# EAGLE design a (EAGLE 9.6.2)
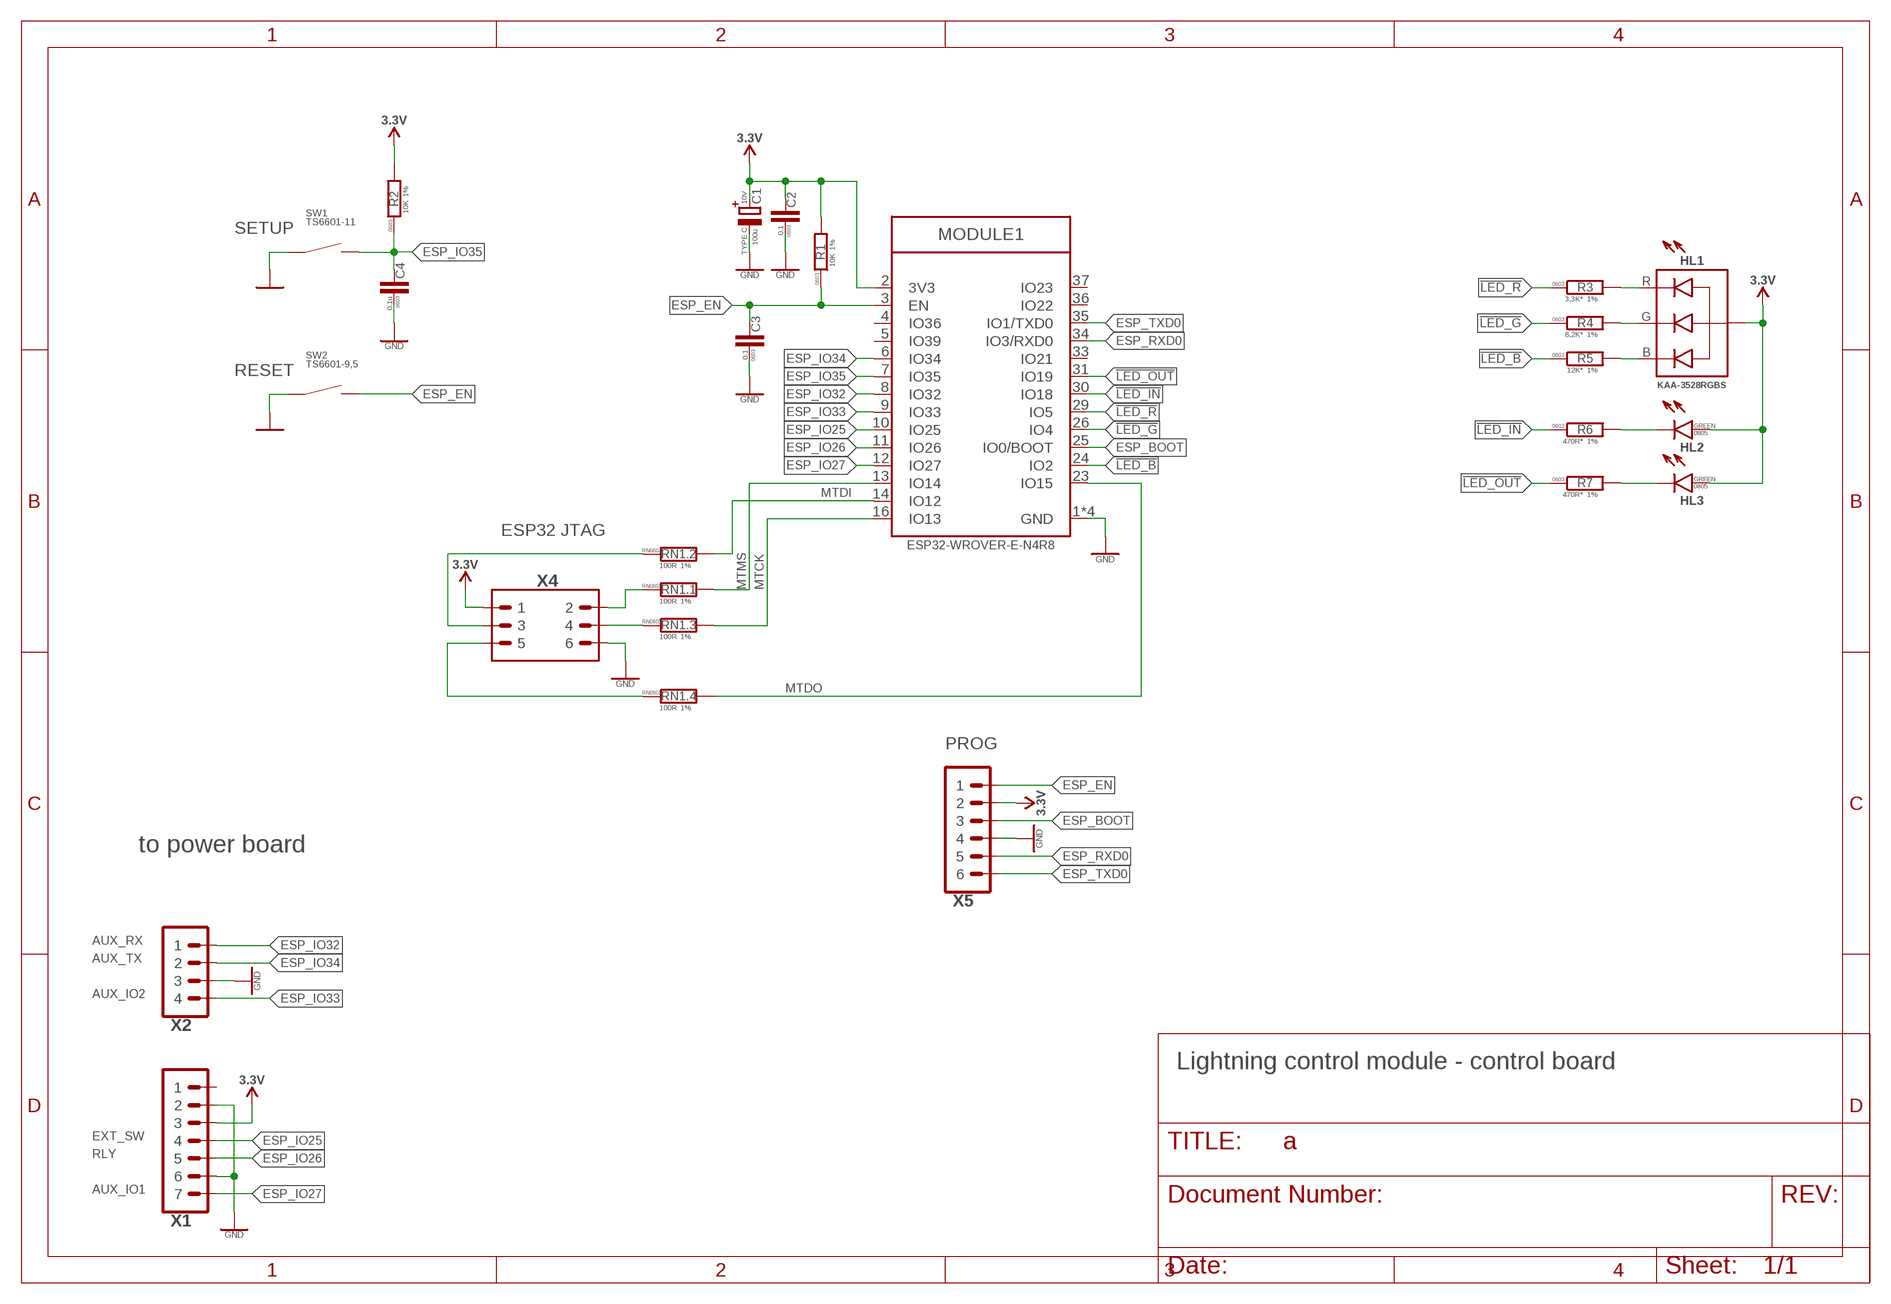
[diagram p0: schematic, sheet 1]

## Parts
C1  100u  CPOL-TANT-TYPE-C  [CTANT_TYPE_C]
C2  0.1  C-0603  [C0603]
C3  0.1  C-0603  [C0603]
C4  0.1u  C-0603  [C0603]
HL1  LED_RGB-KAA-3528RGBS  [LED3528]
HL2  LED-0805  [LED0805]
HL3  LED-0805  [LED0805]
MODULE1  ESP32-WROVER-(I)E  [ESP32-WROVER-E]
R1  10K  R-1%-0603  [R0603]
R2  10K  R-1%-0603  [R0603]
R3  3,3K*  R-1%-0603  [R0603]
R4  8,2K*  R-1%-0603  [R0603]
R5  12K*  R-1%-0603  [R0603]
R6  470R*  R-1%-0603  [R0603]
R7  470R*  R-1%-0603  [R0603]
RN1  100R  RN-1%-0603  [R_4X0603]
SW1  TS6601-11  TACT_SWITCH-6X6-PTH  [SW4-6.0X6.0X5.0MM]
SW2  TS6601-9,5  TACT_SWITCH-6X6-PTH  [SW4-6.0X6.0X5.0MM]
X1  PINHEAD_1X07-2.54  [1X07-PTH-2.54]
X2  PINHEAD_1X04-2.54  [1X04-PTH-2.54]
X4  PINHEAD_2X03-PTH-2.54  [2X03-PTH-2.54]
X5  PINHEAD_1X06-2-MALE  [1X06-PTH-2]

## Nets
!LED_B: MODULE1.24(IO2) R5.1
!LED_G: MODULE1.26(IO4) R4.1
!LED_IN: MODULE1.30(IO18) R6.1
!LED_OUT: MODULE1.31(IO19) R7.1
!LED_R: MODULE1.29(IO5) R3.1
ESP_BOOT: MODULE1.25(IO0/BOOT) X5.3
ESP_EN: C3.2 MODULE1.3(EN) R1.1 SW2.2 SW2.3 X5.1
ESP_IO25: MODULE1.10(IO25) X1.4
ESP_IO26: MODULE1.11(IO26) X1.5
ESP_IO27: MODULE1.12(IO27) X1.7
ESP_IO32: MODULE1.8(IO32) X2.1
ESP_IO33: MODULE1.9(IO33) X2.4
ESP_IO34: MODULE1.6(IO34) X2.2
ESP_IO35: C4.2 MODULE1.7(IO35) R2.1 SW1.2 SW1.3
ESP_RXD0: MODULE1.34(IO3/RXD0) X5.5
ESP_TXD0: MODULE1.35(IO1/TXD0) X5.6
GND: C1.- C2.1 C3.1 C4.1 MODULE1.1(GND) MODULE1.15(GND) MODULE1.38(GND) MODULE1.39(GND) SW1.1 SW1.4 SW2.1 SW2.4 X1.2 X1.6 X2.3 X4.6 X5.4
MTCK: MODULE1.16(IO13) RN1.6
MTDI: MODULE1.14(IO12) RN1.7
MTDO: MODULE1.23(IO15) RN1.5
MTMS: MODULE1.13(IO14) RN1.8
N$1: HL1.4(B) R5.2
N$2: HL1.3(G) R4.2
N$4: HL1.1(R) R3.2
N$8: HL2.C R6.2
N$18: HL3.C R7.2
N$124: RN1.4 X4.5
N$150: RN1.1 X4.2
N$213: RN1.2 X4.3
N$216: RN1.3 X4.4
VDD_3V3: C1.+ C2.2 HL1.2(A) HL2.A HL3.A MODULE1.2(3V3) R1.2 R2.2 X1.3 X4.1 X5.2 ; supply symbol labelled 3.3V
Unconnected: MODULE1.4(IO36) MODULE1.5(IO39) MODULE1.33(IO21) MODULE1.36(IO22) MODULE1.37(IO23) X1.1

## Notes on the sheet
- SETUP
- RESET
- ESP32 JTAG
- PROG
- to power board
- AUX_RX
- AUX_TX
- AUX_IO2
- Lightning control module - control board
- EXT_SW
- RLY
- AUX_IO1

## Library data of the parts
C1 = rc:CPOL: Polar electrolytic or tantalum capacitor; PACKAGE: TYPE C; VOLTAGE: 10V
C2-C4 = rc:C; PACKAGE: 0603
HL1 = rc:LED_RGB; MANF: Kingbright; MANF#: KAA-3528RGBS
HL2 HL3 = rc:LED: Light emitting diode; COLOR: GREEN; PACKAGE: 0805
MODULE1 = ali_modules:ESP32-WROVER-(I)E: ESP32-WROVER-(I)E module Datasheet <https://documentation.espressif.com/esp32-wrover-e_esp32-wrover-ie_datasheet_en.pdf>; MANF: Espressif Systems; MANF#: ESP32-WROVER-E-N4R8
R1-R7 = rc:R; PACKAGE: 0603; TOLERANCE: 1%
RN1 = rc:RN; PACKAGE: RN0603; TOLERANCE: 1%
SW1 SW2 = mechanical:TACT_SWITCH: tact switch; MANF: KLS; MANF#: KLS7-TS6601-4,3-180
X1 = pinhead:PINHEAD_1X07: pinheader 7P
X2 = pinhead:PINHEAD_1X04
X4 = pinhead:PINHEAD_2X03
X5 = pinhead:PINHEAD_1X06: pinheader 6P

## Net classes
1 24V: clearance 0.305 mm
12 Vbat: width 0.229 mm, clearance 0.305 mm

## Board
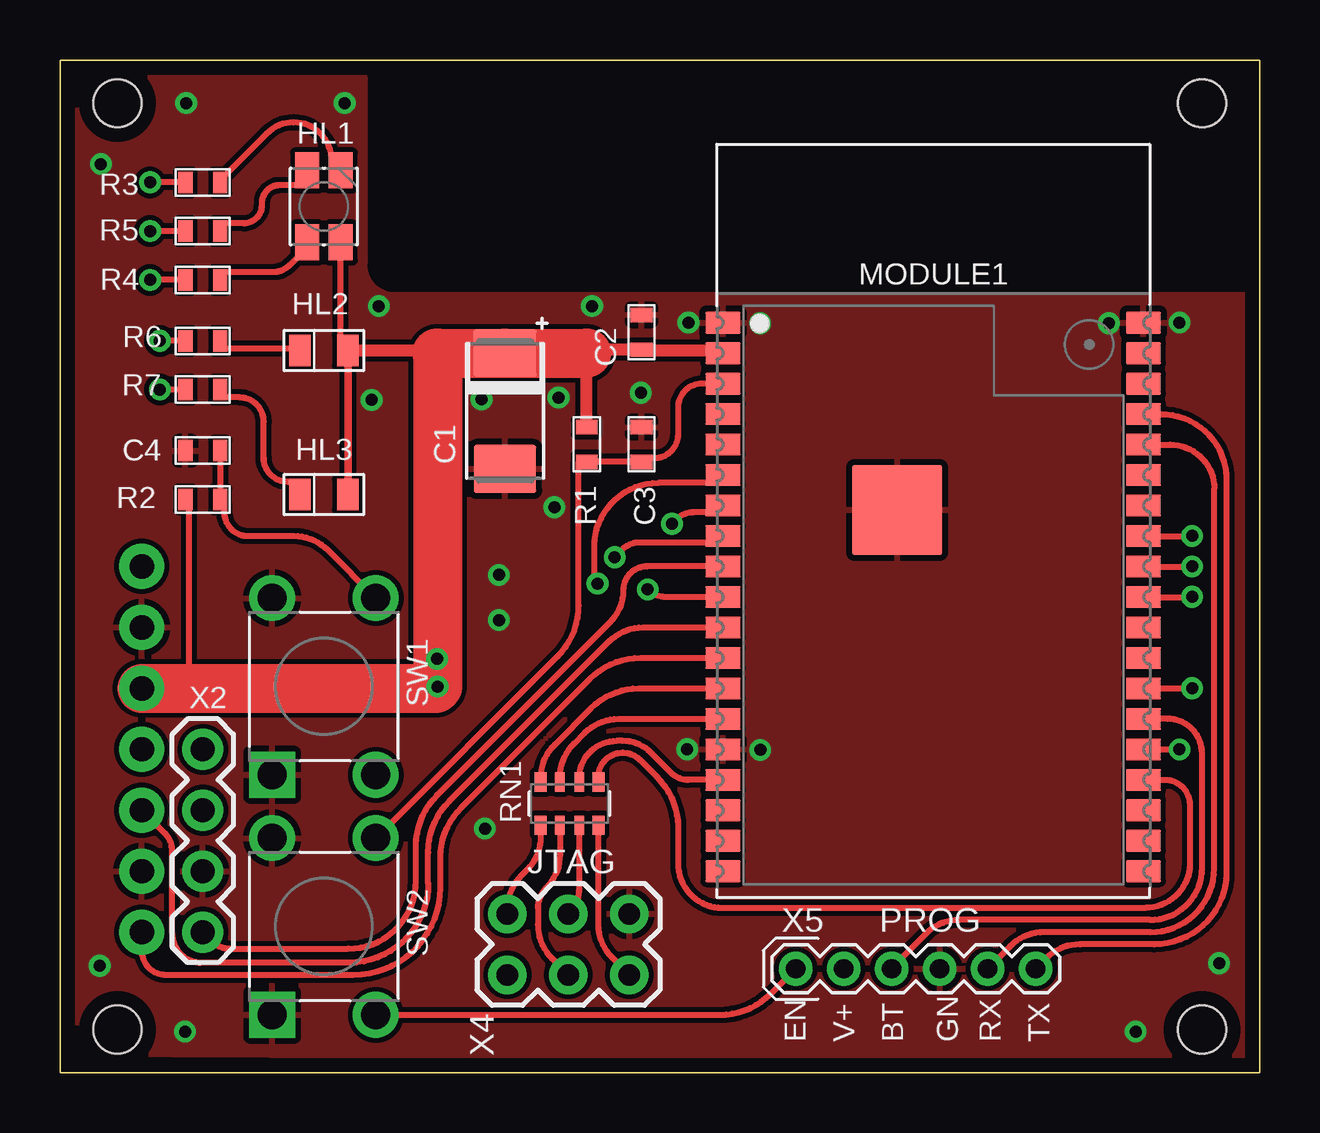
[diagram p1: board, top side]
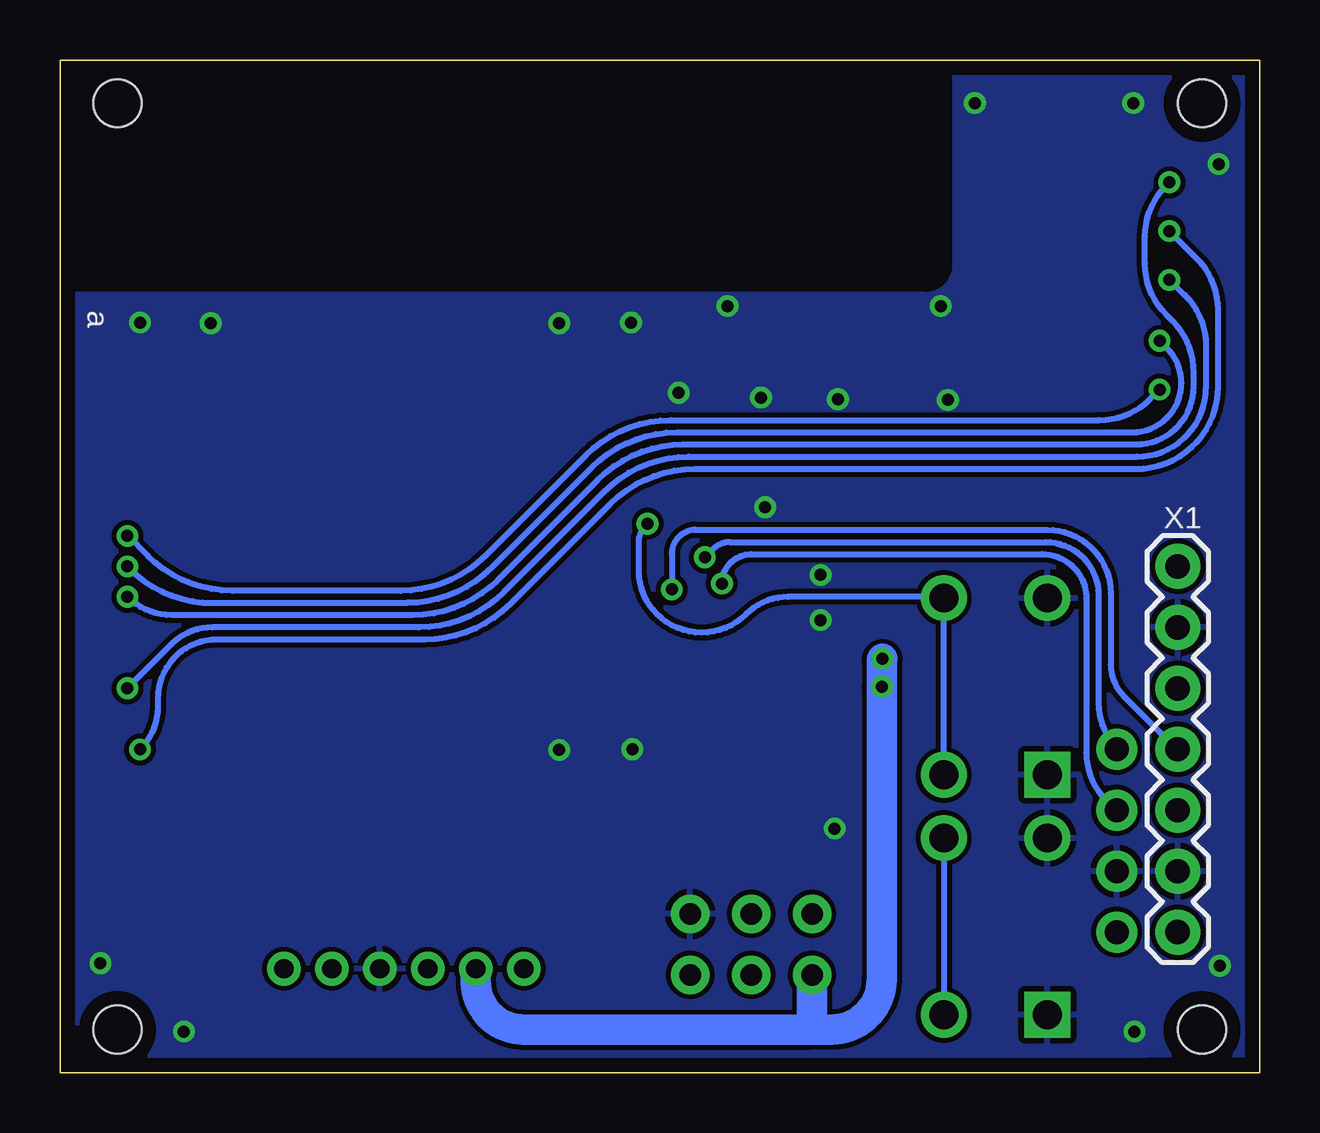
[diagram p2: board, bottom side, seen from below]

Size 50 x 42.2 mm. Coordinates in mm from the lower left corner, seen from the top.
Outline: 0,42.2 50,42.2 50,0 0,0 0,42.2
Copper layers (1*16): Top 0.035mm / dielectric 1.5mm / Bottom 0.035mm
Design rules "pds019_lit *": minimum track width 8mil, minimum drill 0.5mm, track to track 8mil, track to pad 8mil, pad to pad 8mil, via to via 8mil, smd to smd 0mil, copper to edge 0.6mm, drill to drill 8mil, minimum pad ring 10mil, minimum via ring 8mil, stop-mask expansion 4mil, vias tented up to drill 2mm, thermal gap 10mil
Holes 2 mm at 2.4,40.4 47.6,40.4 47.6,1.8 2.4,1.8
tRestrict: 3 lines
bRestrict: 3 lines

### Footprints (pad centres in the part's own frame; a part is rotated, then mirrored left to right if it is on the bottom)
CTANT_TYPE_C = smd 1.981 x 2.591: + -2.413,0; - 2.413,0
C0603 = smd 0.6 x 0.9: 1 -0.725,0; 2 0.725,0
LED3528 = smd 1.5 x 1: 1 1.5,-0.7; 2 -1.5,-0.7; 3 -1.5,0.7; 4 1.5,0.7
LED0805 = smd 0.9 x 1.3: A -1,0; C 1,0
ESP32-WROVER-E = smd 1.473 x 0.914: 1 -8.763,8.255; 2 -8.763,6.985; 3 -8.763,5.715; 4 -8.763,4.445; 5 -8.763,3.175; 6 -8.763,1.905; 7 -8.763,0.635; 8 -8.763,-0.635; 9 -8.763,-1.905; 10 -8.763,-3.175; 11 -8.763,-4.445; 12 -8.763,-5.715; 13 -8.763,-6.985; 14 -8.763,-8.255; 15 -8.763,-9.525; 16 -8.763,-10.795; 17 -8.763,-12.065; 18 -8.763,-13.335; 19 -8.763,-14.605; 20 8.763,-14.605; 21 8.763,-13.335; 22 8.763,-12.065; 23 8.763,-10.795; 24 8.763,-9.525; 25 8.763,-8.255; 26 8.763,-6.985; 27 8.763,-5.715; 28 8.763,-4.445; 29 8.763,-3.175; 30 8.763,-1.905; 31 8.763,-0.635; 32 8.763,0.635; 33 8.763,1.905; 34 8.763,3.175; 35 8.763,4.445; 36 8.763,5.715; 37 8.763,6.985; 38 8.763,8.255 | smd 3.75 x 3.75: 39 -1.5,0.455
R0603 = smd 0.6 x 0.9: 1 -0.725,0; 2 0.725,0
R_4X0603 = smd 0.8 x 0.5: 1 -0.9,1.2; 4 -0.9,-1.2; 5 0.9,-1.2; 8 0.9,1.2 | smd 0.8 x 0.4: 2 -0.9,0.4; 3 -0.9,-0.4; 6 0.9,-0.4; 7 0.9,0.4
SW4-6.0X6.0X5.0MM = drill 1.2 pad 1.905 square: 1 -3.683,2.159 | drill 1.2 pad 1.905: 2 -3.683,-2.159; 3 3.683,-2.159; 4 3.683,2.159
1X07-PTH-2.54 = drill 1.016 pad 1.88: 1 -7.62,0; 2 -5.08,0; 3 -2.54,0; 4 0,0; 5 2.54,0; 6 5.08,0; 7 7.62,0
1X04-PTH-2.54 = drill 1 pad 1.7: 1 -3.81,0; 2 -1.27,0; 3 1.27,0; 4 3.81,0
2X03-PTH-2.54 = drill 0.9 pad 1.6: 1 -1.27,2.54; 2 1.27,2.54; 3 -1.27,0; 4 1.27,0; 5 -1.27,-2.54; 6 1.27,-2.54
1X06-PTH-2 = drill 0.8 pad 1.4: 1 -5,0; 2 -3,0; 3 -1,0; 4 1,0; 5 3,0; 6 5,0

### Placement (x,y rotation side)
C1  18.55,27.58 270 top
C2  24.24,30.85 270 top
C3  24.24,26.18 270 top
C4  5.95,25.93 0 top
HL1  11,36.1 90 top
HL2  11,30.1 180 top
HL3  11,24.1 180 top
MODULE1  36.4,23 0 top
R1  21.95,26.18 90 top
R2  5.95,23.89 180 top
R3  5.95,37.1 0 top
R4  5.95,33.04 0 top
R5  5.95,35.07 0 top
R6  5.95,30.5 0 top
R7  5.95,28.47 0 top
RN1  21.24,11.22 90 top
SW1  11,16.1 90 top
SW2  11,6.1 90 top
U$2  [D3MG_PCB_UP]  25,21.1 0 top
X1  3.41,13.48 270 bottom
X2  5.95,9.67 270 top
X4  21.19,5.35 90 top
X5  35.67,4.34 0 top

### Tracks (layer width: path | path; a pad name or v marks a point on that pad's centre or on a via)
!LED_B  (via drill 0.5)
  Top 0.254: MODULE1.24 v46.66,13.48 | v46.66,13.48 | R5.1 v3.76,35.07
  Bottom 0.254: v46.66,13.48 arc-45 45.92,15.27 45.92,15.59 arc90 43.46,18.05 34.78,18.05 arc-45 31.25,19.52 27.07,23.7 arc45 23.53,25.16 5.14,25.16 arc-90 1.73,28.58 1.73,31.8 arc-45 2.61,33.92 v3.76,35.07
!LED_G  (via drill 0.5)
  Top 0.254: MODULE1.26 v47.19,16.02 | R4.1 v3.76,33.04
  Bottom 0.254: v47.19,16.02 45.36,17.85 arc45 43.65,18.56 35.04,18.56 arc-45 31.5,20.03 27.32,24.21 arc45 23.79,25.67 5.1,25.67 arc-90 2.23,28.54 2.23,30.28 arc-45 3.11,32.41 3.75,33.04 v3.76,33.04
!LED_IN  (via drill 0.5)
  Top 0.254: MODULE1.30 v47.19,21.1 | R6.1 v4.16,30.5 | v4.16,30.5
  Bottom 0.254: v4.16,30.5 3.86,30.19 arc135 5.31,26.69 24.29,26.69 arc-45 27.83,25.22 32.01,21.04 arc45 35.55,19.58 43.62,19.58 arc45 47.15,21.04 47.19,21.08 v47.19,21.1
!LED_OUT  (via drill 0.5)
  Top 0.254: MODULE1.31 v47.19,22.37 | R7.1 v4.16,28.47 | v4.16,28.47
  Bottom 0.254: v4.16,28.47 4.56,28.08 arc45 6.68,27.2 24.55,27.2 arc-45 28.08,25.73 32.27,21.55 arc45 35.8,20.08 42.81,20.08 arc45 46.34,21.55 47.16,22.37 v47.19,22.37
!LED_R  (via drill 0.5)
  Top 0.254: MODULE1.29 v47.19,19.83 | R3.1 v3.76,37.1
  Bottom 0.254: v3.76,37.1 3.9,36.97 arc-45 4.77,34.84 4.77,33.72 arc-45 3.9,31.59 3.62,31.32 arc45 2.74,29.2 2.74,28.6 arc90 5.16,26.18 24.04,26.18 arc-45 27.57,24.72 31.76,20.53 arc45 35.29,19.07 45.34,19.07 arc45 v47.18,19.83 v47.19,19.83
ESP_BOOT
  Top 0.254: X5.3 34.65,4.35 34.65,4.36 36.08,5.78 arc-45 37.49,6.37 45.44,6.37 arc90 47.61,8.53 47.61,13.31 arc90 46.17,14.75 MODULE1.25
ESP_EN
  Top 0.254: SW2.3 13.18,9.78 20.74,17.35 arc45 21.62,19.47 21.62,25.46 R1.1 C3.2 24.39,25.61 24.76,25.61 arc90 25.76,26.61 25.76,27.72 arc-90 26.76,28.72 MODULE1.3 | SW2.2 27.51,2.42 arc45 29.63,3.3 X5.1
  Bottom 0.254: SW2.3 SW2.2
ESP_IO25  (via drill 0.5)
  Top 0.254: MODULE1.10 25.23,19.83 arc-45 24.52,20.12 v24.5,20.14
  Bottom 0.254: v24.5,20.14 24.5,21.62 arc90 23.49,22.62 8.85,22.62 arc90 6.2,19.98 6.2,17.01 arc-45 5.66,15.7 3.44,13.48 X1.4
ESP_IO26
  Top 0.254: X1.5 4.39,9.96 arc-45 4.68,9.26 4.68,5.81 arc90 5.89,4.59 12.05,4.59 arc90 15.35,7.88 15.35,9.19 arc-45 16.23,11.31 22.89,17.97 arc-45 24.3,18.56 MODULE1.11
ESP_IO27
  Top 0.254: X1.7 3.41,5.08 arc90 4.41,4.08 12.22,4.08 arc90 15.86,7.72 15.86,8.94 arc-45 16.73,11.06 22.09,16.41 arc-45 24.21,17.29 MODULE1.12
ESP_IO32  (via drill 0.5)
  Top 0.254: v23.12,21.48 v23.12,21.49 23.43,21.8 arc-45 24.14,22.09 27.37,22.09 MODULE1.8
  Bottom 0.254: v23.12,21.48 22.78,21.82 arc45 22.07,22.12 8.93,22.12 arc90 6.71,19.9 6.71,15.39 arc-45 5.95,13.55 X2.1 | v23.12,21.48
ESP_IO33
  Top 0.254: X2.4 6.34,5.47 arc45 7.05,5.17 12.01,5.17 arc90 14.84,8 14.84,9.44 arc-45 15.72,11.57 22.92,18.77 arc45 23.48,20.1 arc-90 24.48,21.1 27.63,21.1 MODULE1.9
ESP_IO34  (via drill 0.5)
  Top 0.254: MODULE1.6 27.31,24.58 24.95,24.58 arc90 22.27,21.91 22.27,20.52 v22.41,20.38
  Bottom 0.254: X2.2 5.99,10.94 6.39,11.34 arc45 7.22,13.35 7.22,19.77 arc-90 9.06,21.61 21.18,21.61 arc-90 v22.41,20.38
ESP_IO35  (via drill 0.5)
  Top 0.254: v25.51,22.88 25.69,23.06 arc-45 26.4,23.35 27.36,23.35 MODULE1.7 | SW1.3 11.16,21.78 arc45 9.74,22.37 7.84,22.37 arc-90 6.84,23.37 6.84,23.73 R2.1 C4.2
  Bottom 0.254: v25.51,22.88 25.58,22.81 arc-45 25.87,22.1 25.87,20.95 arc-135 21.41,19.1 arc45 19.66,19.83 13.82,19.83 13.78,19.78 SW1.3 SW1.2
ESP_RXD0
  Top 0.254: MODULE1.34 46.27,26.18 arc-90 48.11,24.33 48.11,8.52 arc-90 45.46,5.86 41.02,5.86 arc45 39.61,5.27 X5.5
ESP_TXD0
  Top 0.254: X5.6 41.1,4.77 arc-45 42.51,5.35 45.61,5.35 arc90 48.62,8.36 48.62,24.71 arc90 45.88,27.45 MODULE1.35
GND  (via drill 0.5)
  other vias: 26.19,31.26 46.67,31.26 43.72,31.23 29.19,31.23 26.14,13.48 29.19,13.45 17.71,10.18 48.32,4.56 44.84,1.72 5.21,1.72 1.66,4.46 1.71,37.86 5.26,40.4 22.18,31.95 13.29,31.95 18.29,18.86 24.21,28.34 11.87,40.4 20.61,23.56 12.99,28.03 20.78,28.14 18.29,20.74 17.57,28.07
  pour Bottom: 0.62,41.67 49.38,41.67 49.38,0.53 0.62,0.78
  pour Top: 0.62,41.67 49.38,41.67 49.38,0.53 0.62,0.78
MTCK
  Top 0.254: RN1.6 21.64,12.27 arc-90 23.2,13.83 23.45,13.83 arc-45 24.63,13.34 25.47,12.5 arc45 26.18,12.21 MODULE1.16
MTDI
  Top 0.254: MODULE1.14 23.28,14.75 arc45 21.87,14.16 21.43,13.72 arc45 20.84,12.3 RN1.7
MTDO
  Top 0.254: RN1.5 22.44,12.33 arc-135 24.17,13.04 24.88,12.33 arc-45 25.76,10.21 25.76,8.72 arc90 27.6,6.88 45.25,6.88 arc90 47.1,8.73 47.1,11.16 arc90 46.05,12.21 MODULE1.23
MTMS
  Top 0.254: MODULE1.13 24.13,16.02 arc45 22.14,15.19 20.63,13.68 arc45 20.04,12.26 RN1.8
N$1
  Top 0.254: R5.2 6.68,35.39 7.66,35.39 arc90 8.41,36.14 8.41,36.23 arc-90 9.16,36.98 10.3,36.98 HL1.4
N$2
  Top 0.254: R4.2 6.68,33.36 8.86,33.36 arc45 9.57,33.65 10.3,34.38 HL1.3
N$4
  Top 0.254: R3.2 6.68,37.2 8.61,39.14 arc-135 11.33,38.01 11.33,37.5 11.72,37.5 11.72,37.58 HL1.1
N$8
  Top 0.254: HL2.C 9.92,30.18 6.68,30.18 R6.2
N$18
  Top 0.254: HL3.C 10,24.62 9.49,24.62 arc-90 8.49,25.62 8.49,27.14 arc90 7.49,28.14 6.68,28.14 R7.2
N$124
  Top 0.254: X4.5 23.03,4.79 arc-45 22.44,6.2 RN1.4
N$150
  Top 0.254: RN1.1 20.04,9.86 arc-45 19.45,8.44 19.24,8.22 arc45 18.65,6.81 X4.2
N$213
  Top 0.254: RN1.2 20.84,9.11 arc-45 20.25,7.7 arc45 19.92,6.89 19.92,6.18 arc45 20.51,4.77 X4.3
N$216
  Top 0.254: RN1.3 21.64,7.72 arc-45 21.19,6.64 X4.4
VDD_3V3  (via drill 0.5)
  Top 0.254: R2.2 5.36,23.76 5.36,16.12 5.46,16.02 | HL2.A 11.7,30.4 HL1.2
  Top 0.305: HL3.A HL2.A
  Top 0.5: MODULE1.2 27.54,30.08 24.29,30.08 C2.2 22.09,30.13 21.95,29.99 R1.2 | HL2.A 15.6,30.1 15.71,29.99
  Top 2.032: 21.95,29.99 C1.+ 15.74,29.99 | 15.74,29.99 v15.74,16.09 15.67,16.02 5.46,16.02 X1.3 | 15.71,29.99 15.74,29.99
  Bottom 1.27: 18.65,1.8 17.86,1.8 arc-90 15.74,3.91 v15.74,16.09 15.74,17.22 v15.71,17.24 | X5.2 32.67,3.8 arc-90 30.67,1.8 18.65,1.8 | X4.1 18.65,1.8

### Text on the board
tPlace: JTAG | PROG | EN | V+ | BT | GN | RX | TX